# EasyEDA schematic Nixie Display Board.json
TITLE: Sheet_1; REV: 1.0; Date: 2021-11-24; Sheet: 1/1; Drawn By: Gustavo Moraes; Company: Your Company
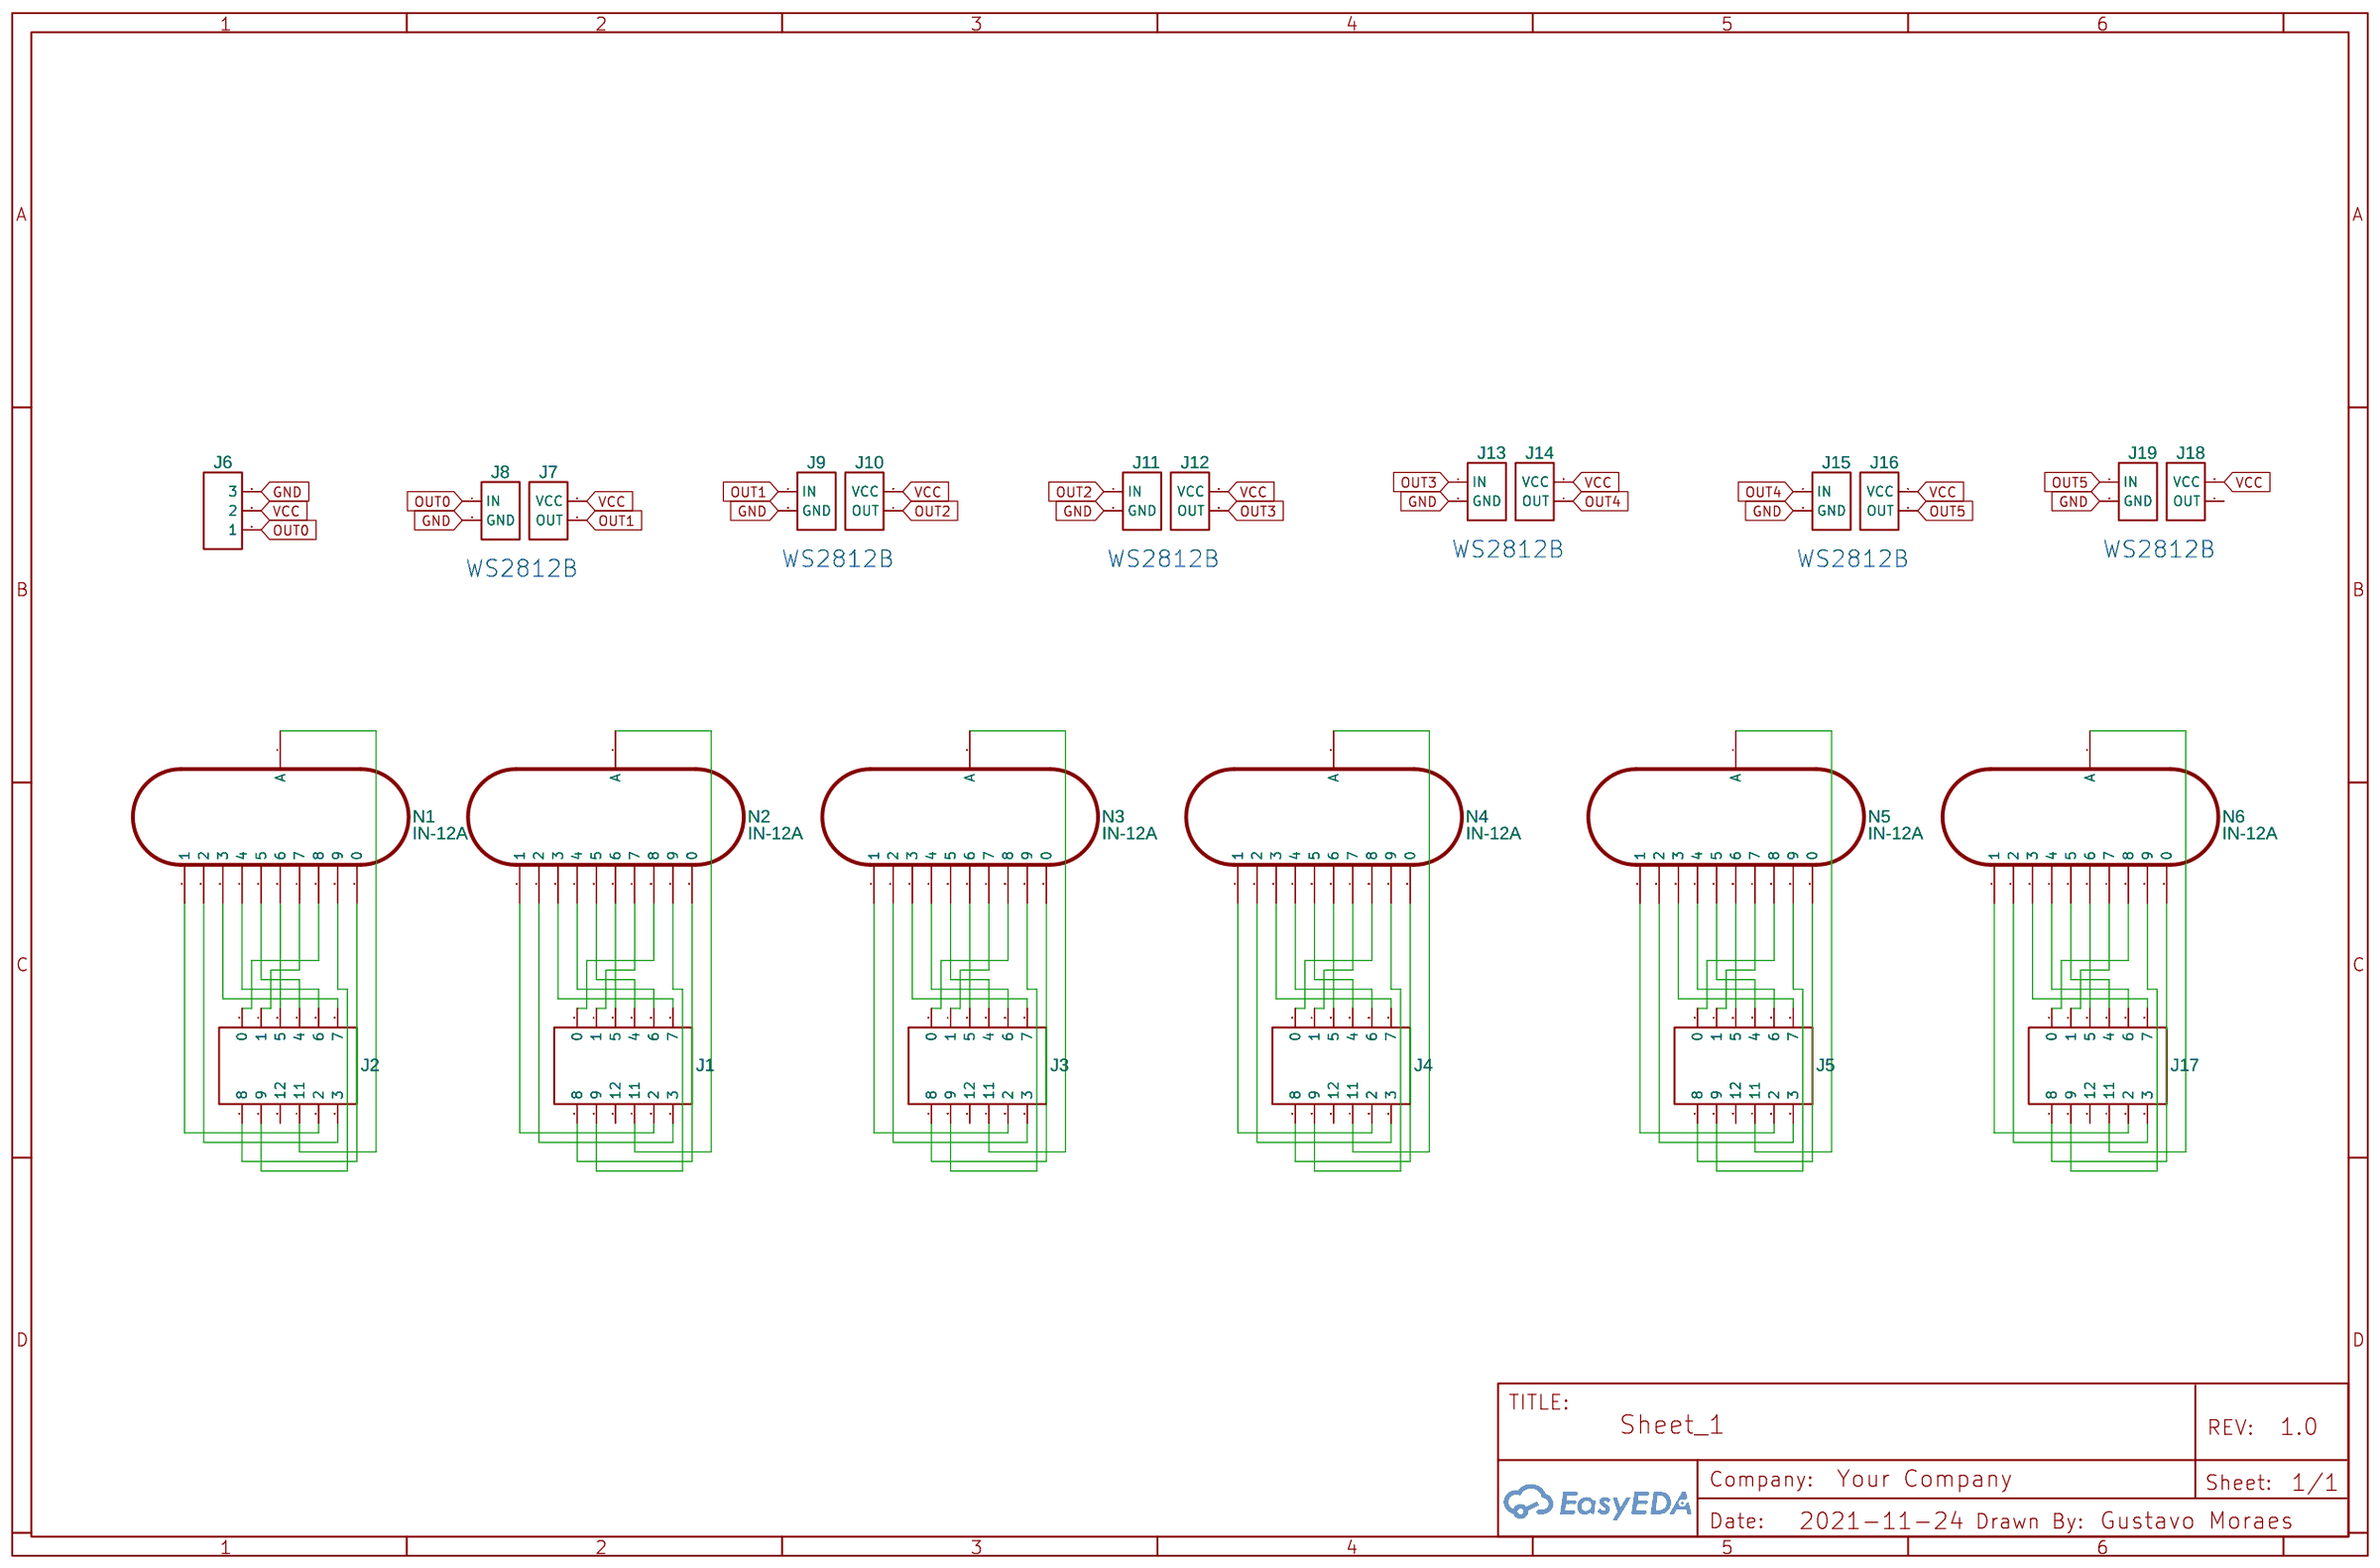
[diagram p0: schematic sheet]

## Parts
J1  HDR-M-2.54_2x6  [HDR-M-2.54_2X6]
J2  HDR-M-2.54_2x6  [HDR-M-2.54_2X6]
J3  HDR-M-2.54_2x6  [HDR-M-2.54_2X6]
J4  HDR-M-2.54_2x6  [HDR-M-2.54_2X6]
J5  HDR-M-2.54_2x6  [HDR-M-2.54_2X6]
J6  HDR-M-2.54_1x3  [HDR-M-2.54_1X3]
J7  HDR-M-2.54_1x2  [HDR-M-2.54_1X2]
J8  HDR-M-2.54_1x2  [HDR-M-2.54_1X2]
J9  HDR-M-2.54_1x2  [HDR-M-2.54_1X2]
J10  HDR-M-2.54_1x2  [HDR-M-2.54_1X2]
J11  HDR-M-2.54_1x2  [HDR-M-2.54_1X2]
J12  HDR-M-2.54_1x2  [HDR-M-2.54_1X2]
J13  HDR-M-2.54_1x2  [HDR-M-2.54_1X2]
J14  HDR-M-2.54_1x2  [HDR-M-2.54_1X2]
J15  HDR-M-2.54_1x2  [HDR-M-2.54_1X2]
J16  HDR-M-2.54_1x2  [HDR-M-2.54_1X2]
J17  HDR-M-2.54_2x6  [HDR-M-2.54_2X6]
J18  HDR-M-2.54_1x2  [HDR-M-2.54_1X2]
J19  HDR-M-2.54_1x2  [HDR-M-2.54_1X2]
N1  IN-12A  [IN-12]
N2  IN-12A  [IN-12]
N3  IN-12A  [IN-12]
N4  IN-12A  [IN-12]
N5  IN-12A  [IN-12]
N6  IN-12A  [IN-12]

## Library data of the parts
J1-J5 J17 = HDR-M-2.54_2x6: Supplier Part: C124388; Supplier: LCSC; Contributor: LCEDA_Lib; Package Display: No
J6 = HDR-M-2.54_1x3: Supplier Part: C180248; Supplier: LCSC; Contributor: LCEDA_Lib
J7-J16 J18 J19 = HDR-M-2.54_1x2: Supplier Part: C124375; Supplier: LCSC; Contributor: LCEDA_Lib
N1-N6 = IN-12A

## Nets
GND: J6.3 J8.2(GND) J9.2(GND) J11.2(GND) J13.2(GND) J15.2(GND) J19.2(GND)
VCC: J6.2 J7.2(VCC) J10.2(VCC) J12.2(VCC) J14.2(VCC) J16.2(VCC) J18.2(VCC)
OUT0: J6.1 J8.1(IN)
OUT1: J7.1(OUT) J9.1(IN)
OUT2: J10.1(OUT) J11.1(IN)
OUT3: J12.1(OUT) J13.1(IN)
OUT4: J14.1(OUT) J15.1(IN)
OUT5: J16.1(OUT) J19.1(IN)
Net-(J1-1): J1.1(8) N2.0
Net-(J1-2): J1.2(0) N2.8
Net-(J1-3): J1.3(9) N2.9
Net-(J1-4): J1.4(1) N2.7
Net-(J1-6): J1.6(5) N2.6
Net-(J1-7): J1.7(11) N2.A
Net-(J1-8): J1.8(4) N2.5
Net-(J1-9): J1.9(2) N2.1
Net-(J1-10): J1.10(6) N2.4
Net-(J1-11): J1.11(3) N2.2
Net-(J1-12): J1.12(7) N2.3
Net-(J2-1): J2.1(8) N1.0
Net-(J2-2): J2.2(0) N1.8
Net-(J2-3): J2.3(9) N1.9
Net-(J2-4): J2.4(1) N1.7
Net-(J2-6): J2.6(5) N1.6
Net-(J2-7): J2.7(11) N1.A
Net-(J2-8): J2.8(4) N1.5
Net-(J2-9): J2.9(2) N1.1
Net-(J2-10): J2.10(6) N1.4
Net-(J2-11): J2.11(3) N1.2
Net-(J2-12): J2.12(7) N1.3
Net-(J3-1): J3.1(8) N3.0
Net-(J3-2): J3.2(0) N3.8
Net-(J3-3): J3.3(9) N3.9
Net-(J3-4): J3.4(1) N3.7
Net-(J3-6): J3.6(5) N3.6
Net-(J3-7): J3.7(11) N3.A
Net-(J3-8): J3.8(4) N3.5
Net-(J3-9): J3.9(2) N3.1
Net-(J3-10): J3.10(6) N3.4
Net-(J3-11): J3.11(3) N3.2
Net-(J3-12): J3.12(7) N3.3
Net-(J4-1): J4.1(8) N4.0
Net-(J4-2): J4.2(0) N4.8
Net-(J4-3): J4.3(9) N4.9
Net-(J4-4): J4.4(1) N4.7
Net-(J4-6): J4.6(5) N4.6
Net-(J4-7): J4.7(11) N4.A
Net-(J4-8): J4.8(4) N4.5
Net-(J4-9): J4.9(2) N4.1
Net-(J4-10): J4.10(6) N4.4
Net-(J4-11): J4.11(3) N4.2
Net-(J4-12): J4.12(7) N4.3
Net-(J5-1): J5.1(8) N5.0
Net-(J5-2): J5.2(0) N5.8
Net-(J5-3): J5.3(9) N5.9
Net-(J5-4): J5.4(1) N5.7
Net-(J5-6): J5.6(5) N5.6
Net-(J5-7): J5.7(11) N5.A
Net-(J5-8): J5.8(4) N5.5
Net-(J5-9): J5.9(2) N5.1
Net-(J5-10): J5.10(6) N5.4
Net-(J5-11): J5.11(3) N5.2
Net-(J5-12): J5.12(7) N5.3
Net-(J17-1): J17.1(8) N6.0
Net-(J17-2): J17.2(0) N6.8
Net-(J17-3): J17.3(9) N6.9
Net-(J17-4): J17.4(1) N6.7
Net-(J17-6): J17.6(5) N6.6
Net-(J17-7): J17.7(11) N6.A
Net-(J17-8): J17.8(4) N6.5
Net-(J17-9): J17.9(2) N6.1
Net-(J17-10): J17.10(6) N6.4
Net-(J17-11): J17.11(3) N6.2
Net-(J17-12): J17.12(7) N6.3

Not connected (* = marked no-connect by the designer): J1 5(12); J2 5(12); J3 5(12); J4 5(12); J5 5(12); J17 5(12); J18 1(OUT)

## Notes on the sheet
- WS2812B
- WS2812B
- WS2812B
- WS2812B
- WS2812B
- WS2812B
